# EAGLE design regulator (EAGLE 6.4)
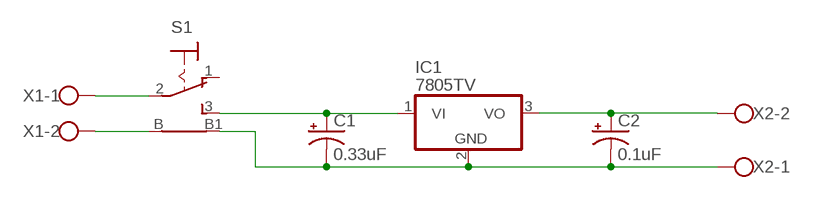
[diagram p0: schematic, sheet 1]

## Parts
C1  0.33uF  CPOL-USE3.5-8  [E3,5-8]
C2  0.1uF  CPOL-USE2-4  [E2-4]
IC1  7805TV  [TO220V]
S1  9070-1W  [9070-1W]
X1  W237-102  [W237-102]
X2  W237-102  [W237-102]

## Nets
GND: C1.- C2.- IC1.2(GND) S1.B1 X2.1
N$1: S1.2(P) X1.1
N$2: S1.B X1.2
N$4: C2.+ IC1.3(VO) X2.2
N$5: C1.+ IC1.1(VI) S1.3(S)
Unconnected: S1.1(O)

## Library data of the parts
C1 C2 = rcl:CPOL-US: POLARIZED CAPACITOR, American symbol
IC1 = linear:78*: Positive VOLTAGE REGULATOR Source: http://cache.national.com/ds/LM/LM78L05.pdf http://www.fairchildsemi.com/ds/LM/LM7805.pdf
S1 = switch:9070-1W: TOGGLE SWITCH Marquardt
X1 X2 = con-wago-500:W237-102: WAGO SCREW CLAMP; MPN: 237-102; OC_FARNELL: unknown; OC_NEWARK: 70K9898

## Board
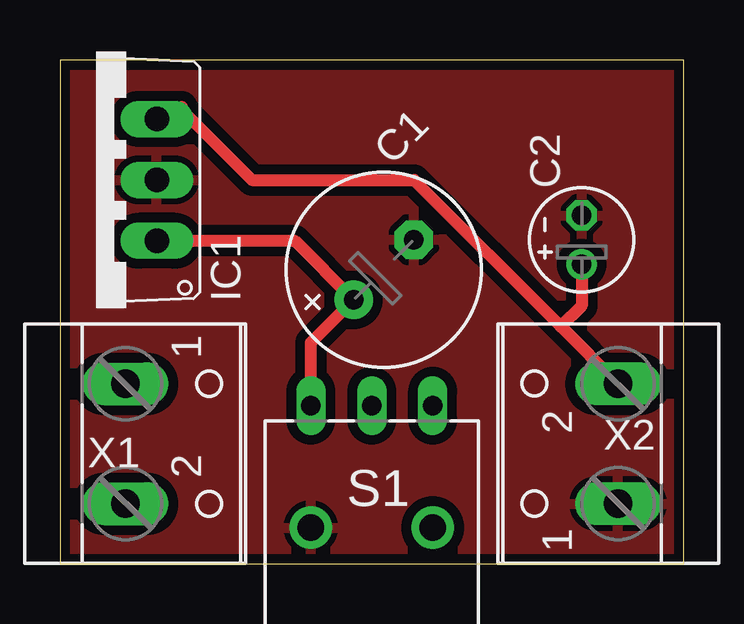
[diagram p1: board, top side]
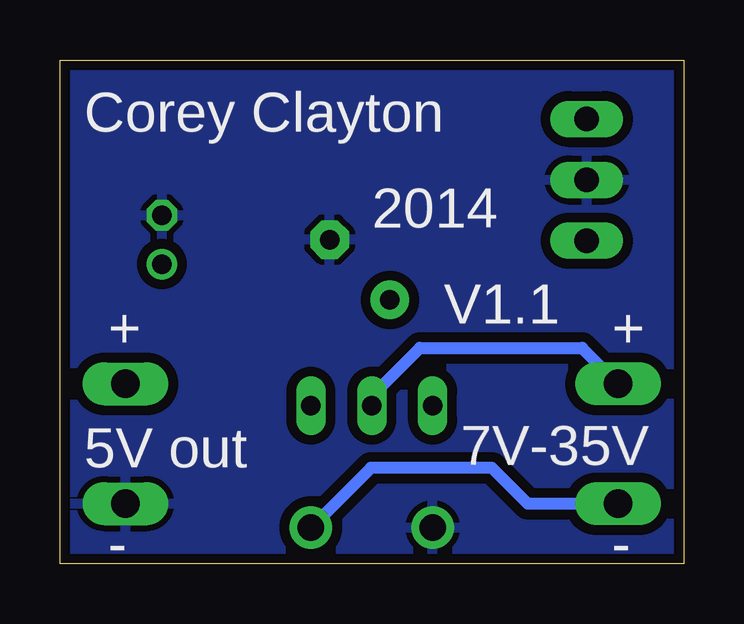
[diagram p2: board, bottom side, seen from below]

Size 26 x 21 mm. Coordinates in mm from the lower left corner, seen from the top.
Outline: 0,0 26,0 26,21 0,21 0,0
Copper layers (1*16): Top 0.0356mm / dielectric 1.5011mm / Bottom 0.0356mm
Design rules "OSHpark": minimum track width 6mil, minimum drill 13mil, track to track 6mil, track to pad 6mil, pad to pad 6mil, via to via 6mil, smd to smd 6mil, copper to edge 15mil, drill to drill 6mil, minimum pad ring 7mil, minimum via ring 7mil, stop-mask expansion 3mil, vias tented up to drill 0mil, thermal gap 10mil

### Footprints (pad centres in the part's own frame; a part is rotated, then mirrored left to right if it is on the bottom)
E3,5-8 = drill 0.813 pad 1.6: + -1.778,0 | drill 0.813 pad 1.6 octagon: - 1.778,0
E2-4 = drill 0.813 pad 1.27: + -1.016,0 | drill 0.813 pad 1.27 octagon: - 1.016,0
TO220V = drill 1.016 long: 1 -2.54,-2.54; 2 0,-2.54; 3 2.54,-2.54
9070-1W = drill 0.813 long: 1 5.08,-2.54; 2 5.08,0; 3 5.08,2.54 | drill 1.118 pad 1.778: B 0,-2.54; B1 0,2.54
W237-102 = drill 1.194 long: 1 -2.5,-1.27; 2 2.5,-1.27

### Placement (x,y rotation side)
C1  13.5,12.25 45 top
C2  21.75,13.5 90 top
IC1  1.5,16 90 top
S1  13,1.5 90 top
X1  4,5 270 top
X2  22,5 90 top

### Tracks (layer width: path | path; a pad name or v marks a point on that pad's centre or on a via)
GND
  pour Bottom (isolate 0.406): -1,22 28,22 28,-1 -1,-1
  pour Top (isolate 0.406): -1,-1 27,-1 27,22 -1,22
N$1
  Bottom 0.502: S1.2 13,7 11,9 4.23,9 X1.1
N$2
  Bottom 0.502: X1.2 6.5,2.5 8,4 13.04,4 S1.B
N$4
  Top 0.152: 21.59,12.7 C2.+ | 22.86,7.62 X2.2 | 5.08,19.05 IC1.3
  Top 0.502: 5.08,19.05 5.08,18.92 8,16 14.77,16 20.89,9.88 | 20.89,9.88 X2.2 | C2.+ 21.75,10.75 20.89,9.88
N$5
  Top 0.502: IC1.1 9.78,13.46 C1.+ 10.46,9.21 S1.3

### Text on the board
bNames: Corey Clayton | 2014 | V1.1 | + | + | 7V-35V | 5V out | - | -